# EAGLE design clockbuddy (EAGLE 9.6.2)
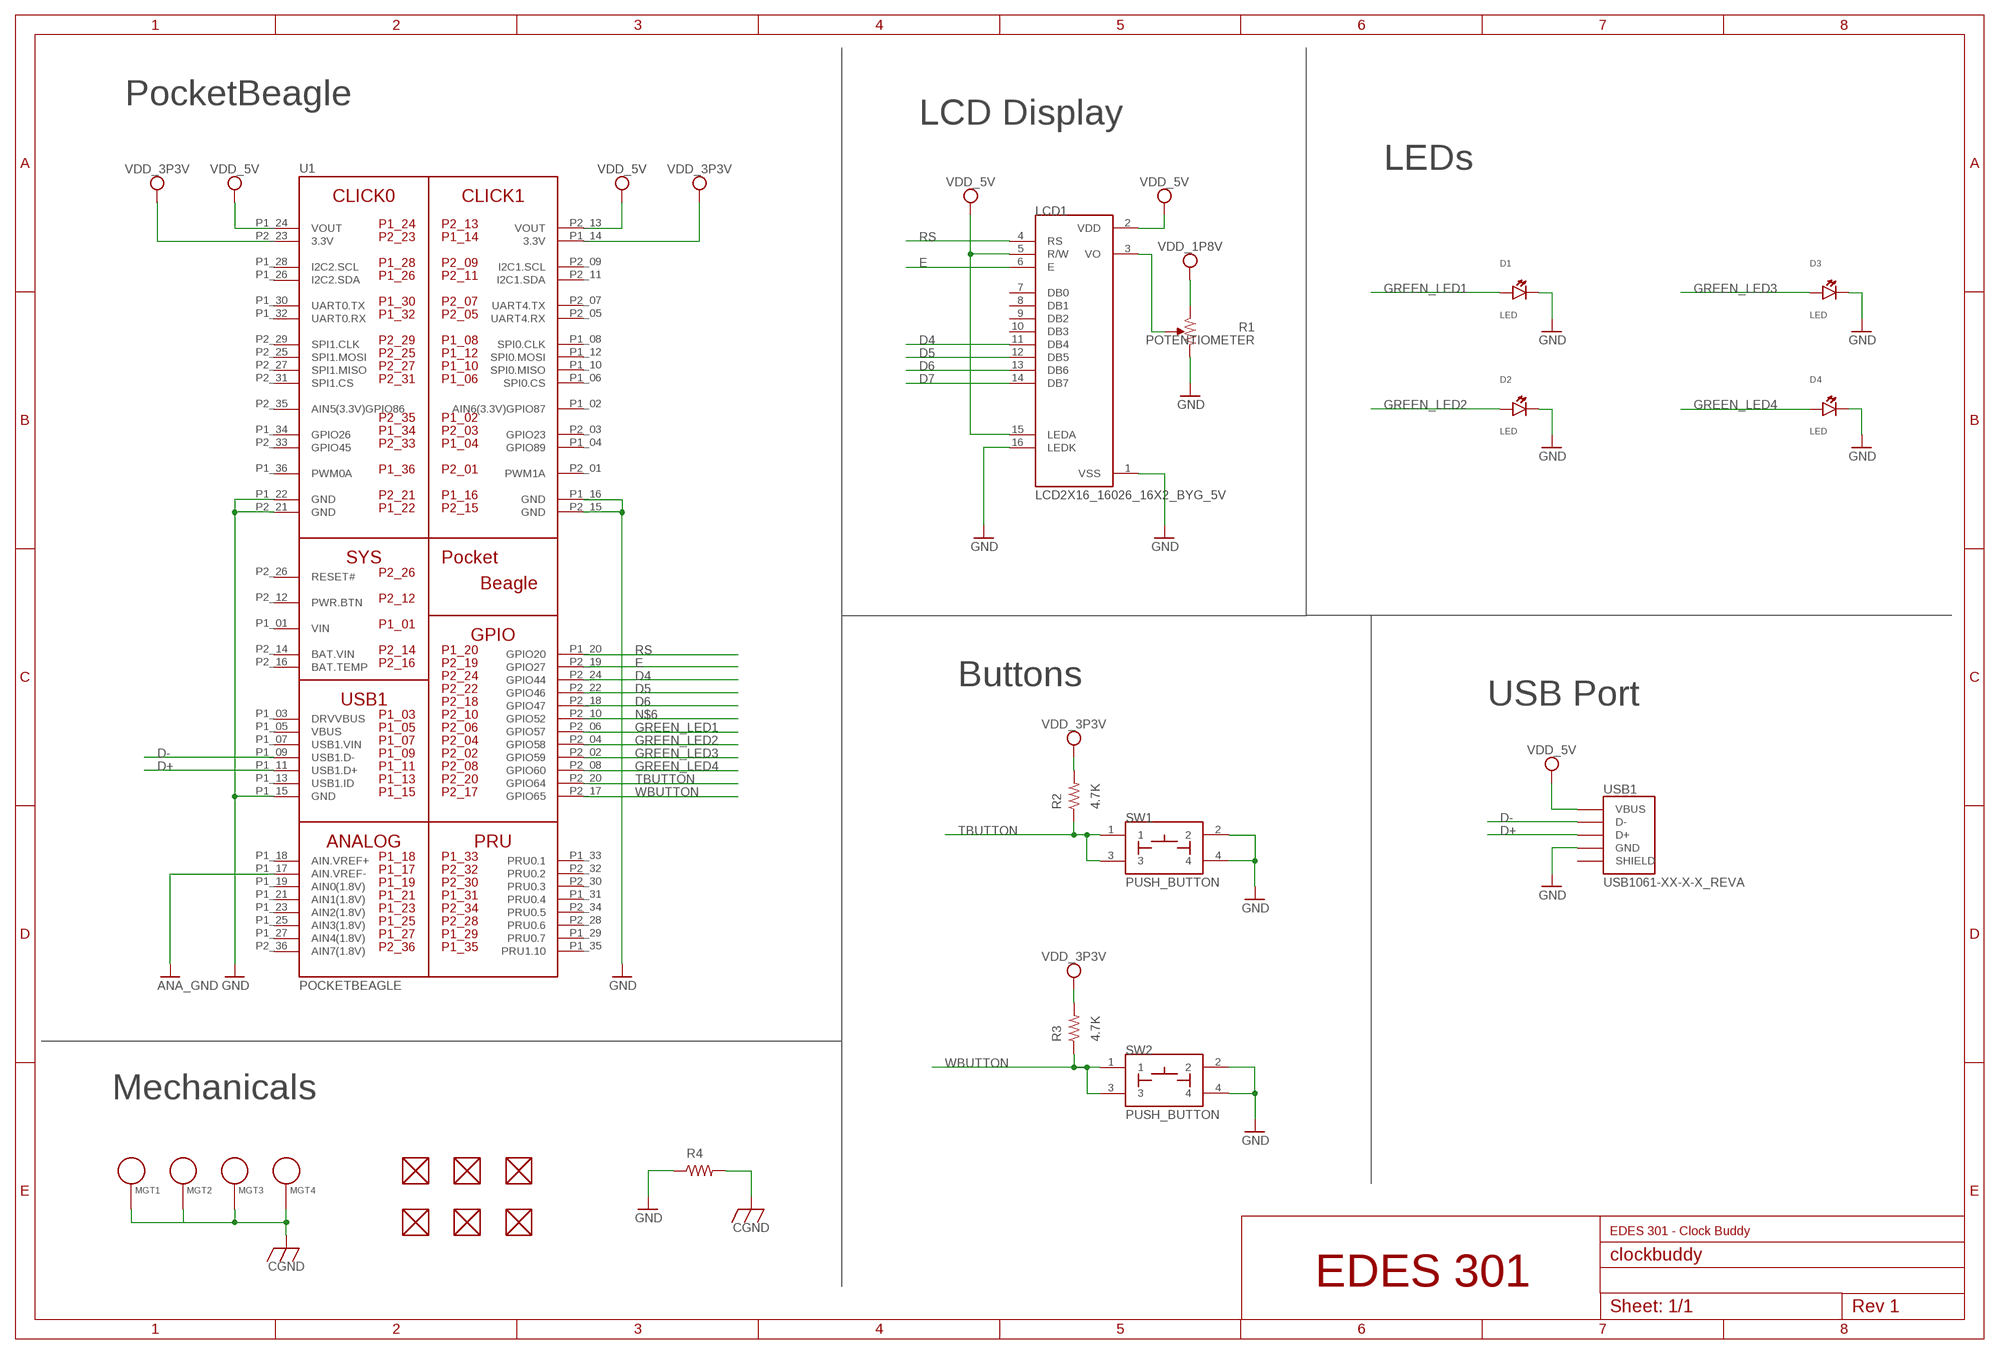
[diagram p0: schematic, sheet 1]

## Parts
D1  LED  [EIA-STD]
D2  LED  [EIA-STD]
D3  LED  [EIA-STD]
D4  LED  [EIA-STD]
FUD1  FIDUCIAL  [FIDUCIAL_40MIL]
FUD2  FIDUCIAL  [FIDUCIAL_40MIL]
FUD3  FIDUCIAL  [FIDUCIAL_40MIL]
FUD4  FIDUCIAL  [FIDUCIAL_40MIL]
FUD5  FIDUCIAL  [FIDUCIAL_40MIL]
FUD6  FIDUCIAL  [FIDUCIAL_40MIL]
LCD1  LCD2X16_16026_16X2_BYG_5V  [LCD_LCD2X16]
MGT1  MOUNTING_HOLE  [MOUNTING_HOLE]
MGT2  MOUNTING_HOLE  [MOUNTING_HOLE]
MGT3  MOUNTING_HOLE  [MOUNTING_HOLE]
MGT4  MOUNTING_HOLE  [MOUNTING_HOLE]
R1  POTENTIOMETER  [POT-PO90S]
R2  4.7K  R_R0603  [R0603]
R3  4.7K  R_R0603  [R0603]
R4  R_R0805  [R0805]
SW1  PUSH_BUTTON  [BUTTON_12.5MM]
SW2  PUSH_BUTTON  [BUTTON_12.5MM]
U1  POCKETBEAGLE  [POCKETBEAGLE]
USB1  USB1061-XX-X-X_REVA  [GCT_USB1061-XX-X-X_REVA]

## Nets
ANA_GND: U1.P1_17(AIN.VREF-)
CGND: MGT1.P$1 MGT2.P$1 MGT3.P$1 MGT4.P$1 R4.2
D4: LCD1.11(DB4) U1.P2_24(GPIO44)
D5: LCD1.12(DB5) U1.P2_22(GPIO46)
D6: LCD1.13(DB6) U1.P2_18(GPIO47)
D7: LCD1.14(DB7)
D+: U1.P1_11(USB1.D+) USB1.3(D+)
D-: U1.P1_09(USB1.D-) USB1.2(D-)
E: LCD1.6(E) U1.P2_19(GPIO27)
GND: D1.CATHODE D2.CATHODE D3.CATHODE D4.CATHODE LCD1.1(VSS) LCD1.16(LEDK) R1.CW R4.1 SW1.2 SW1.4 SW2.2 SW2.4 U1.P1_15(GND) U1.P1_16(GND) U1.P1_22(GND) U1.P2_15(GND) U1.P2_21(GND) USB1.4(GND)
GREEN_LED1: D1.ANODE U1.P2_06(GPIO57)
GREEN_LED2: D2.ANODE U1.P2_04(GPIO58)
GREEN_LED3: D3.ANODE U1.P2_02(GPIO59)
GREEN_LED4: D4.ANODE U1.P2_08(GPIO60)
N$6: U1.P2_10(GPIO52)
N$9: LCD1.3(VO) R1.S
RS: LCD1.4(RS) U1.P1_20(GPIO20)
TBUTTON: R2.1 SW1.1 SW1.3 U1.P2_20(GPIO64)
VDD_1P8V: R1.CCW
VDD_3P3V: R2.2 R3.2 U1.P1_14(3.3V) U1.P2_23(3.3V)
VDD_5V: LCD1.2(VDD) LCD1.5(R/W) LCD1.15(LEDA) U1.P1_24(VOUT) U1.P2_13(VOUT) USB1.1(VBUS)
WBUTTON: R3.1 SW2.1 SW2.3 U1.P2_17(GPIO65)
Unconnected: FUD1.P$1 FUD2.P$1 FUD3.P$1 FUD4.P$1 FUD5.P$1 FUD6.P$1 LCD1.7(DB0) LCD1.8(DB1) LCD1.9(DB2) LCD1.10(DB3) U1.P1_02(AIN6(3.3V)GPIO87) U1.P1_03(DRVVBUS) U1.P1_04(GPIO89) U1.P1_05(VBUS) U1.P1_06(SPI0.CS) U1.P1_07(USB1.VIN) U1.P1_08(SPI0.CLK) U1.P1_10(SPI0.MISO) U1.P1_12(SPI0.MOSI) U1.P1_13(USB1.ID) U1.P1_18(AIN.VREF+) U1.P1_19(AIN0(1.8V)) U1.P1_21(AIN1(1.8V)) U1.P1_23(AIN2(1.8V)) U1.P1_25(AIN3(1.8V)) U1.P1_26(I2C2.SDA) U1.P1_27(AIN4(1.8V)) U1.P1_28(I2C2.SCL) U1.P1_29(PRU0.7) U1.P1_30(UART0.TX) U1.P1_31(PRU0.4) U1.P1_32(UART0.RX) U1.P1_33(PRU0.1) U1.P1_34(GPIO26) U1.P1_35(PRU1.10) U1.P1_36(PWM0A) U1.P2_01(PWM1A) U1.P2_03(GPIO23) U1.P2_05(UART4.RX) U1.P2_07(UART4.TX) U1.P2_09(I2C1.SCL) U1.P2_11(I2C1.SDA) U1.P2_12(PWR.BTN) U1.P2_16(BAT.TEMP) U1.P2_25(SPI1.MOSI) U1.P2_26(RESET#) U1.P2_27(SPI1.MISO) U1.P2_28(PRU0.6) U1.P2_29(SPI1.CLK) U1.P2_30(PRU0.3) U1.P2_31(SPI1.CS) U1.P2_32(PRU0.2) U1.P2_33(GPIO45) U1.P2_34(PRU0.5) U1.P2_35(AIN5(3.3V)GPIO86) U1.P2_36(AIN7(1.8V))

## Notes on the sheet
- PocketBeagle
- LCD Display
- LEDs
- Buttons
- USB Port
- Mechanicals
- EDES 301 - Clock Buddy
- EDES 301
- 1/1

## Power pins joined to a net without a drawn wire
BAT.VIN: U1.P2_14(BAT.VIN)
SHIELD: USB1.5(SHIELD) USB1.6(SHIELD)
VIN: U1.P1_01(VIN)

## Library data of the parts
D1-D4 = clockbuddy:LED: EIA-STD LED, LTST-C191TBKT
FUD1-FUD6 = clockbuddy:FIDUCIAL
LCD1 = clockbuddy:LCD2X16: Check availability <https://pricing.snapeda.com/parts/LCD2X16/mikroElektronika/view-part?ref=eda>; AVAILABILITY: Not in stock; CHECK_PRICES: https://www.snapeda.com/parts/LCD2X16/mikroElektronika/view-part/?ref=eda; DESCRIPTION: Display; Display: LCD 2x16 characters (blue backlight); MF: mikroElektronika; MP: LCD2X16; PACKAGE: None; PRICE: None; SNAPEDA_LINK: https://www.snapeda.com/parts/LCD2X16/mikroElektronika/view-part/?ref=snap
MGT1-MGT4 = clockbuddy:MOUNTING_HOLE: Chassis Mounting Hole w/GND connection ability
R1 = clockbuddy:POTENTIOMETER: Potentiometer - Examples: P090S-14T20BR10K (987-1277-ND)
R2-R4 = clockbuddy:R_: RESISTOR, American symbol
SW1 SW2 = clockbuddy:PUSH_BUTTON
U1 = clockbuddy:POCKETBEAGLE
USB1 = clockbuddy:USB1061-XX-X-X_REVA: Check availability <https://pricing.snapeda.com/parts/USB1061-GF-L-A/Global%20Connector%20Technology/view-part?ref=eda>; AVAILABILITY: In Stock; CHECK_PRICES: https://www.snapeda.com/parts/USB1061-GF-L-A/Global+Connector+Technology/view-part/?ref=eda; DESCRIPTION: USB-A (USB TYPE-A) USB 2.0 Plug Connector 4 Position Board Edge, Cutout; Surface Mount; Through Hole, Right Angle; MF: Global Connector Technology; MP: USB1061-GF-L-A; PACKAGE: None; PRICE: None; SNAPEDA_LINK: https://www.snapeda.com/parts/USB1061-GF-L-A/Global+Connector+Technology/view-part/?ref=snap

## Board
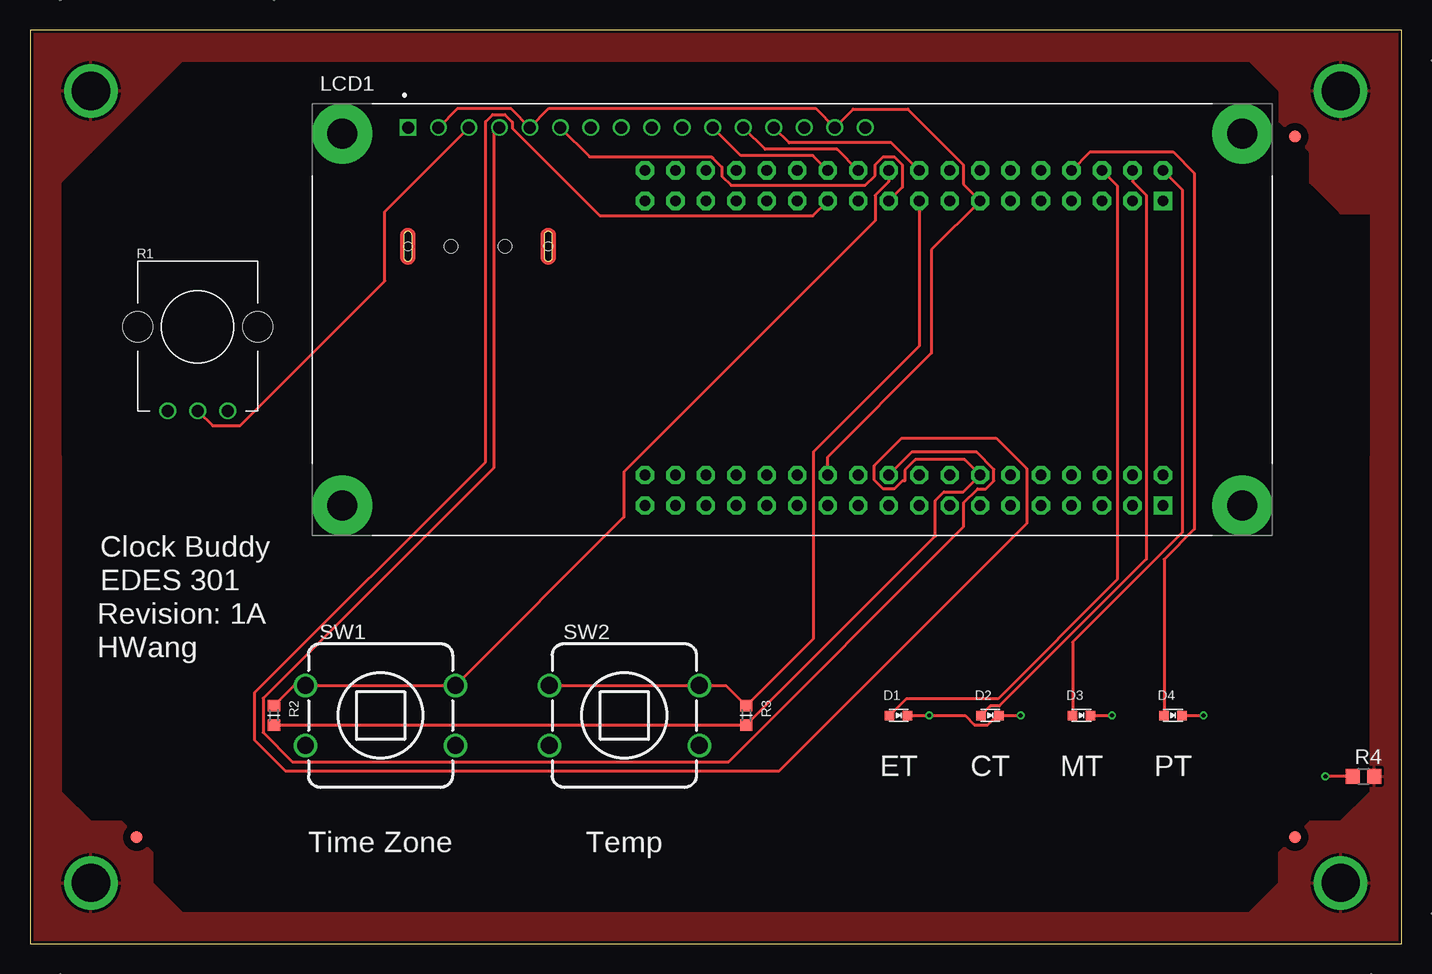
[diagram p1: board, top side]
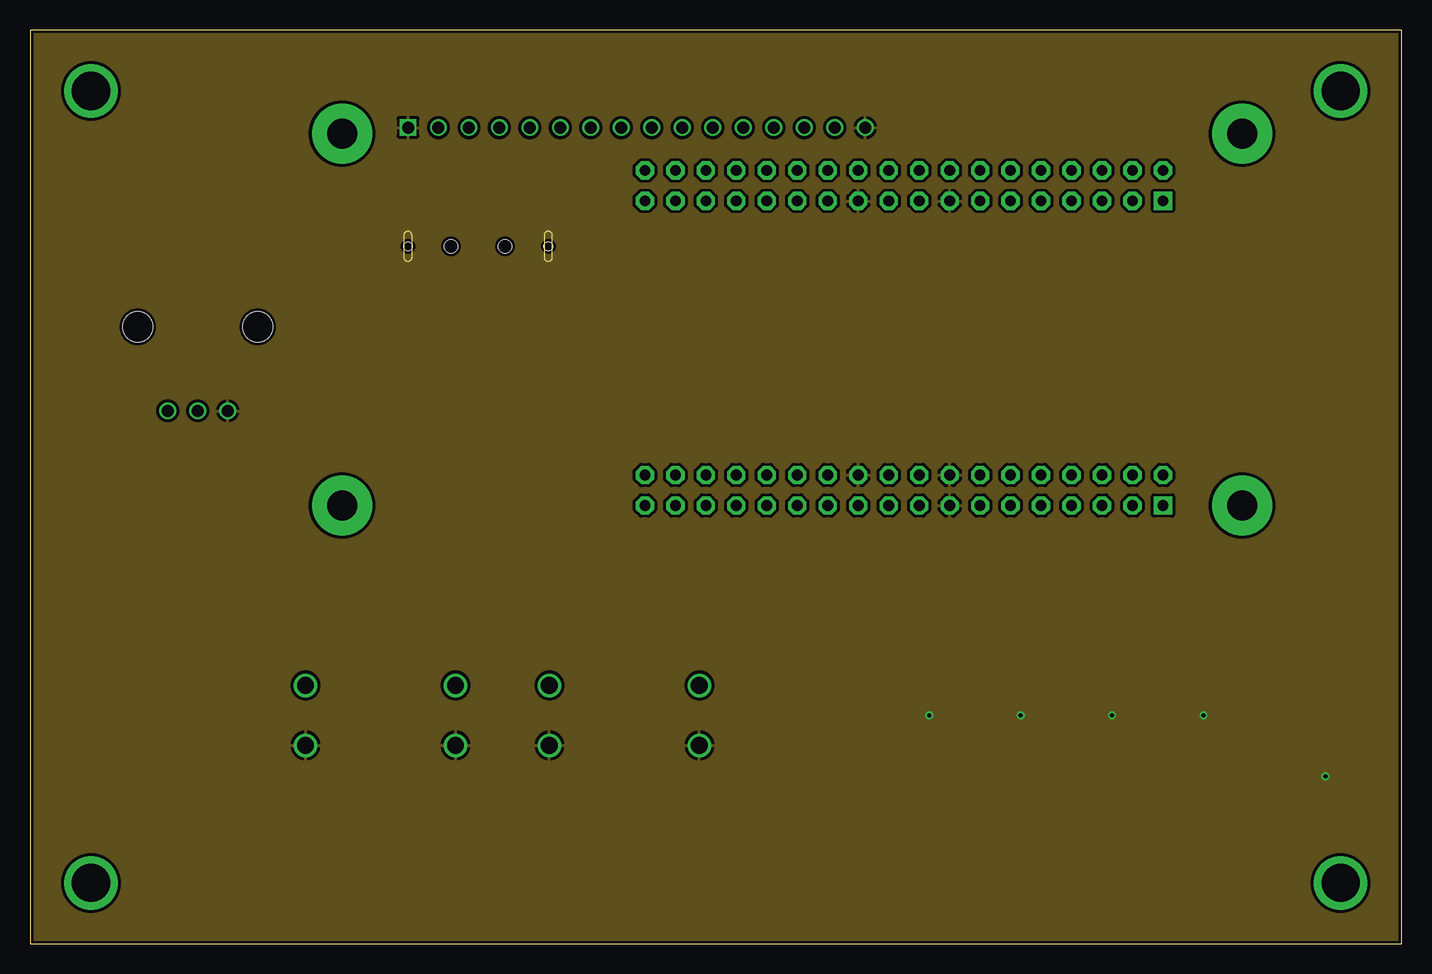
[diagram p2: board, inner layer Route2]
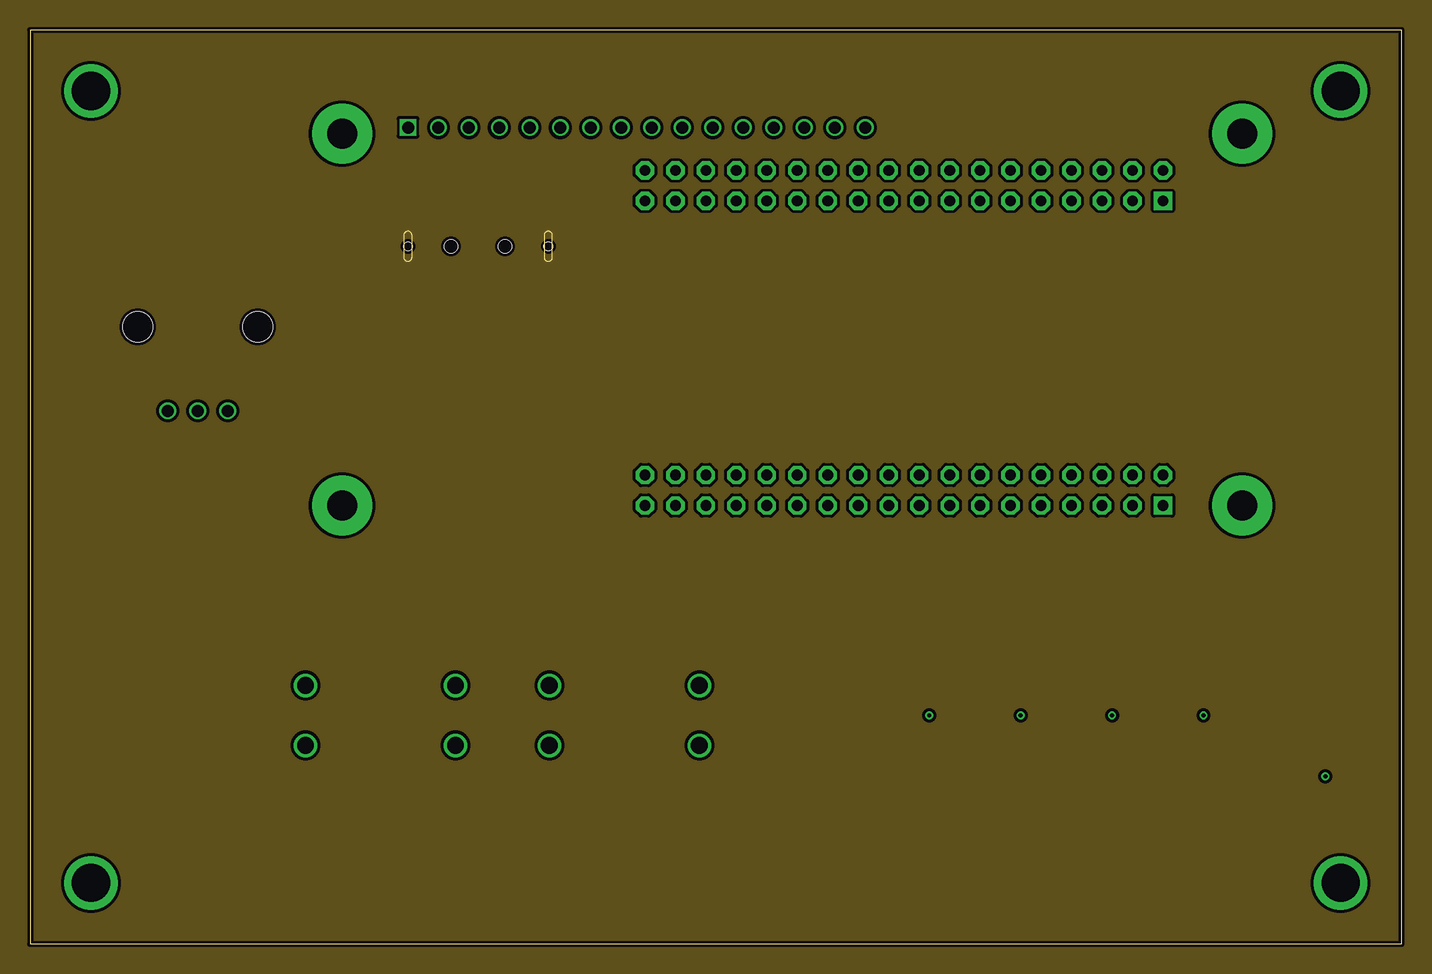
[diagram p3: board, inner layer Route15]
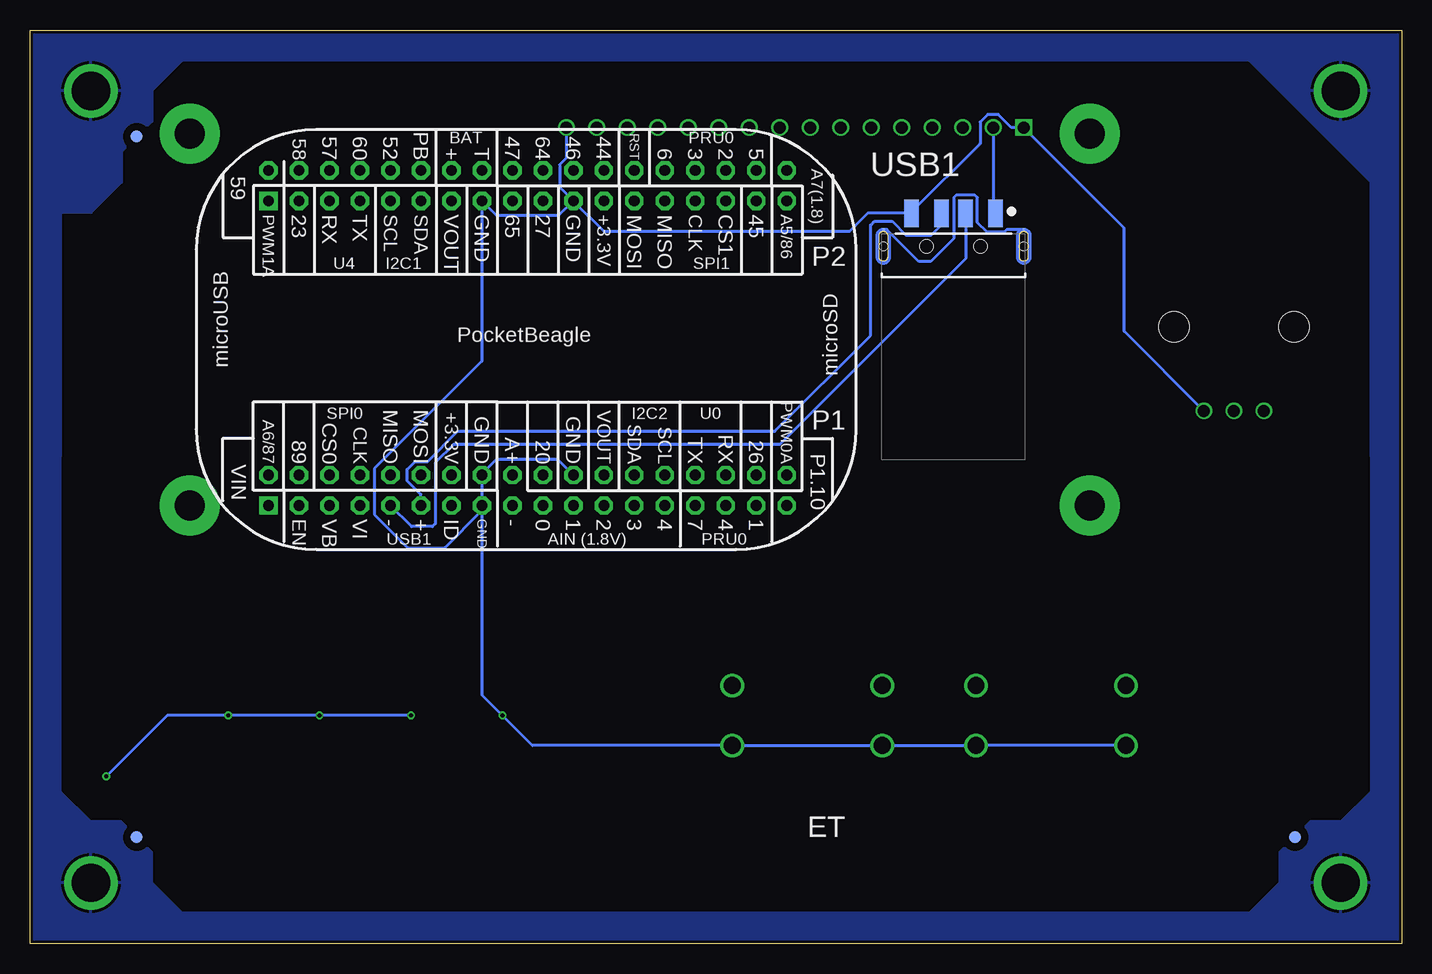
[diagram p4: board, bottom side, seen from below]

Size 114.3 x 76.2 mm. Coordinates in mm from the lower left corner, seen from the top.
Outline: 0,0 114.3,0 114.3,76.2 0,76.2 0,0
Copper layers (1*2*15*16): Top 0.035mm / dielectric 0.23mm / Route2 0.035mm / dielectric 0.93mm / Route15 0.035mm / dielectric 0.23mm / Bottom 0.035mm
Design rules "ENGI301_4lyr": minimum track width 10mil, minimum drill 12mil, track to track 10mil, track to pad 10mil, pad to pad 10mil, via to via 10mil, smd to smd 10mil, copper to edge 10mil, drill to drill 12mil, minimum pad ring 6mil, minimum via ring 6mil, stop-mask expansion 3mil, vias tented up to drill 25mil, thermal gap 10mil

### Footprints (pad centres in the part's own frame; a part is rotated, then mirrored left to right if it is on the bottom)
EIA-STD = smd 0.8 x 0.8: ANODE -0.75,0; CATHODE 0.75,0
FIDUCIAL_40MIL = smd 1.016 x 1.016: P$1 0,0
LCD_LCD2X16 = drill 1 square: 1 -32,16 | drill 1: 2 -29.46,16; 3 -26.92,16; 4 -24.38,16; 5 -21.84,16; 6 -19.3,16; 7 -16.76,16; 8 -14.22,16; 9 -11.68,16; 10 -9.14,16; 11 -6.6,16; 12 -4.06,16; 13 -1.52,16; 14 1.02,16; 15 3.56,16; 16 6.1,16 | drill 2.5 pad 5: S1 -37.5,15.5; S2 37.5,15.5; S3 37.5,-15.5; S4 -37.5,-15.5
MOUNTING_HOLE = drill 3.175 pad 4.445: P$1 0,0
POT-PO90S = drill 1: CCW -2.5,0; CW 2.5,0; S 0,0 | hole 2.5: -5,7; 5,7
R0603 = smd 0.95 x 1.031: 1 -0.8,0; 2 0.8,0
R0805 = smd 1.143 x 1.27: 1 -0.889,0; 2 0.889,0
BUTTON_12.5MM = drill 1.4: 1 -6.25,2.5; 2 -6.25,-2.5; 3 6.25,2.5; 4 6.25,-2.5
POCKETBEAGLE = drill 0.889 pad 1.524 square: P1_01 5.91,3.53; P2_01 5.91,28.93 | drill 0.889 pad 1.524 octagon: P1_02 5.91,6.07; P1_03 8.45,3.53; P1_04 8.45,6.07; P1_05 10.99,3.53; P1_06 10.99,6.07; P1_07 13.53,3.53; P1_08 13.53,6.07; P1_09 16.07,3.53; P1_10 16.07,6.07; P1_11 18.61,3.53; P1_12 18.61,6.07; P1_13 21.15,3.53; P1_14 21.15,6.07; P1_15 23.69,3.53; P1_16 23.69,6.07; P1_17 26.23,3.53; P1_18 26.23,6.07; P1_19 28.77,3.53; P1_20 28.77,6.07; P1_21 31.31,3.53; P1_22 31.31,6.07; P1_23 33.85,3.53; P1_24 33.85,6.07; P1_25 36.39,3.53; P1_26 36.39,6.07; P1_27 38.93,3.53; P1_28 38.93,6.07; P1_29 41.47,3.53; P1_30 41.47,6.07; P1_31 44.01,3.53; P1_32 44.01,6.07; P1_33 46.55,3.53; P1_34 46.55,6.07; P1_35 49.09,3.53; P1_36 49.09,6.07; P2_02 5.91,31.47; P2_03 8.45,28.93; P2_04 8.45,31.47; P2_05 10.99,28.93; P2_06 10.99,31.47; P2_07 13.53,28.93; P2_08 13.53,31.47; P2_09 16.07,28.93; P2_10 16.07,31.47; P2_11 18.61,28.93; P2_12 18.61,31.47; P2_13 21.15,28.93; P2_14 21.15,31.47; P2_15 23.69,28.93; P2_16 23.69,31.47; P2_17 26.23,28.93; P2_18 26.23,31.47; P2_19 28.77,28.93; P2_20 28.77,31.47; P2_21 31.31,28.93; P2_22 31.31,31.47; P2_23 33.85,28.93; P2_24 33.85,31.47; P2_25 36.39,28.93; P2_26 36.39,31.47; P2_27 38.93,28.93; P2_28 38.93,31.47; P2_29 41.47,28.93; P2_30 41.47,31.47; P2_31 44.01,28.93; P2_32 44.01,31.47; P2_33 46.55,28.93; P2_34 46.55,31.47; P2_35 49.09,28.93; P2_36 49.09,31.47
GCT_USB1061-XX-X-X_REVA = smd 1.2 x 2.3: 1 3.5,2.75; 2 1,2.75; 3 -1,2.75; 4 -3.5,2.75 | smd 0.2 x 0.2: 5 -5.85,1.4; 6 5.85,1.4 | hole 1.1: -2.25,0; 2.25,0 | hole 0.7: -5.85,0; 5.85,0

### Placement (x,y rotation side)
D1  72.39,19.05 0 top
D2  80.01,19.05 0 top
D3  87.63,19.05 0 top
D4  95.25,19.05 0 top
FUD1  8.89,8.89 0 top
FUD2  105.41,8.89 0 top
FUD3  105.41,67.31 0 top
FUD4  8.89,8.89 0 bottom
FUD5  105.41,8.89 0 bottom
FUD6  105.41,67.31 0 bottom
LCD1  63.5,52.07 0 top
MGT1  5.08,5.08 0 top
MGT2  5.08,71.12 0 top
MGT3  109.22,71.12 0 top
MGT4  109.22,5.08 0 top
R1  13.97,44.45 0 top
R2  20.32,19.05 270 top
R3  59.69,19.05 270 top
R4  111.12,13.97 0 top
SW1  29.21,19.05 0 top
SW2  49.53,19.05 0 top
U1  100.33,33.02 0 bottom
USB1  37.34,58.17 0 bottom

### Tracks (layer width: path | path; a pad name or v marks a point on that pad's centre or on a via)
CGND
  pour Top: -2.54,40.64 2.54,40.64 2.54,12.7 5.08,10.16 7.62,10.16 10.16,7.62 10.16,5.08 12.7,2.54 101.6,2.54 104.14,5.08 104.14,7.62 106.68,10.16 109.22,10.16 111.76,12.7 111.76,40.64 116.84,40.64 116.84,-2.54 -2.54,-2.54
  pour Top: 2.54,40.64 2.54,63.5 5.08,66.04 12.7,73.66 101.6,73.66 104.14,71.12 104.14,68.58 106.68,66.04 106.68,63.5 109.22,60.96 111.76,60.96 111.76,40.64 116.84,40.64 116.84,78.74 -2.54,78.74 -2.54,40.64
  pour Bottom: -2.54,40.64 2.54,40.64 2.54,12.7 5.08,10.16 7.62,10.16 10.16,7.62 10.16,5.08 12.7,2.54 101.6,2.54 104.14,5.08 104.14,7.62 106.68,10.16 109.22,10.16 111.76,12.7 111.76,40.64 116.84,40.64 116.84,-2.54 -2.54,-2.54
  pour Bottom: -2.54,40.64 2.54,40.64 2.54,63.5 12.7,73.66 101.6,73.66 104.14,71.12 104.14,68.58 106.68,66.04 106.68,63.5 109.22,60.96 111.76,60.96 111.76,40.64 116.84,40.64 116.84,76.2 116.84,78.74 -2.54,78.74
D4
  Top 0.254: LCD1.11 59.23,65.73 65.23,65.73 U1.P2_24
D5
  Top 0.254: U1.P2_22 67.27,66.24 61.27,66.24 LCD1.12
D6
  Top 0.254: U1.P2_18 71.79,66.8 63.25,66.8 LCD1.13
D+
  Bottom 0.254: U1.P1_11 81.72,37.47 82.86,38.62 82.86,39.56 82.19,40.23 81.15,40.23 78.64,42.75 52.22,42.75 44.25,50.72 44.25,59.94 43.94,60.25 42.46,60.25 41.31,59.1 39.2,59.1 38.34,59.96 USB1.3
D-
  Bottom 0.254: USB1.2 36.34,57.13 51.82,41.66 78.99,41.66 80.52,40.13 80.52,35.05 80.77,34.8 82.51,34.8 U1.P1_09
E
  Top 0.254: 56.89,65.53 56.79,65.63 46.64,65.63 LCD1.6 | 56.89,65.53 56.9,65.53 | 56.89,65.53 57.66,64.77 57.66,64.01 58.42,63.25 69.6,63.25 70.42,64.07 70.42,64.96 71.09,65.63 72.03,65.63 72.13,65.53 72.14,65.53 72.7,64.96 72.7,63.09 U1.P2_19
GND  (via drill 0.35)
  Top 0.254: R4.1 v107.95,13.97 | D3.CATHODE v90.17,19.05 | D4.CATHODE v97.79,19.05 | v82.55,19.05 D2.CATHODE 80.6,19.05 79.82,18.27 78.7,18.27 77.92,19.05 v74.93,19.05 D1.CATHODE
  Bottom 0.254: R1.CW 23.11,51.09 23.11,59.68 LCD1.1 32.51,68.07 33.59,69.15 34.49,69.15 35.12,68.52 35.12,66.73 40.89,60.96 | LCD1.16 69.6,65.53 70.16,64.96 70.16,63.09 U1.P2_21 | U1.P2_21 70.26,60.71 75.4,60.71 U1.P2_15 76.64,48.58 85.6,39.62 85.6,35.81 82.8,33.02 79.76,33.02 76.64,36.14 U1.P1_15 | U1.P2_21 66.51,59.44 45.97,59.44 44.45,60.96 40.89,60.96 | 40.89,60.96 40.88,60.96 USB1.4 | U1.P1_15 U1.P1_16 76.64,39.18 75.44,40.39 70.32,40.39 U1.P1_22 | U1.P1_15 76.64,20.76 v74.93,19.05 72.43,16.55 SW2.4 SW2.2 SW1.4 SW1.2 | v82.55,19.05 v90.17,19.05 v97.79,19.05 102.87,19.05 v107.95,13.97
  pour Route2 (rank 6): -5.08,81.28 119.38,81.28 119.38,-5.08 -5.08,-5.08
GREEN_LED1
  Top 0.254: U1.P2_06 90.6,63.23 90.6,30.38 80.67,20.45 73.04,20.45 D1.ANODE
GREEN_LED2
  Top 0.254: U1.P2_04 91.88,63.57 93.02,62.42 93.02,32.08 80.77,19.83 80.04,19.83 D2.ANODE
GREEN_LED3
  Top 0.254: U1.P2_02 96.01,62.9 96.01,34.3 86.88,25.17 D3.ANODE
GREEN_LED4
  Top 0.254: U1.P2_08 88.35,66.04 95.25,66.04 97.03,64.26 97.03,34.58 94.5,32.05 D4.ANODE
N$9
  Top 0.254: R1.S 15.21,43.2 17.5,43.2 29.57,55.27 29.57,61.06 LCD1.3
RS
  Top 0.254: LCD1.4 38.99,68.07 38.64,67.71 38.64,39.7 19.42,20.48 19.42,17.62 21.85,15.19 58.21,15.19 77.78,34.76 77.78,36.77 78.96,37.95 79.65,37.95 80.32,38.62 80.32,39.56 78.89,40.99 73.47,40.99 U1.P1_20
SHIELD
  Bottom 0.254: USB1.6 32.9,59.57 33.13,59.33 34.55,59.33 35.36,60.15 35.36,62.22 35.58,62.45 37.1,62.45 37.32,62.22 37.32,58.82 39.24,56.9 40.23,56.9 42.9,59.57 USB1.5
TBUTTON
  Top 0.254: R2.1 22.02,21.55 SW1.1 SW1.3 49.49,35.58 49.49,39.36 70.42,60.29 70.42,62.42 71.56,63.57 U1.P2_20
VDD_3D3V
  pour Route15 (rank 6): -7.62,83.82 121.92,83.82 121.92,-7.62 -7.62,-7.62
VDD_3P3V
  Top 0.254: R2.2 R3.2 75.44,34 75.44,36.96 76.17,37.69 77.78,37.69 U1.P1_14 77.88,40.39 73.78,40.39 72.9,39.5 72.9,38.61 72.69,38.61 72.03,37.95 71.09,37.95 70.36,38.68 70.36,39.88 72.64,42.16 80.52,42.16 83.06,39.62 83.06,35.05 62.41,14.4 21.31,14.4 18.75,16.97 18.75,20.98 37.96,40.2 37.96,68.57 38.55,69.15 39.57,69.15 40.2,68.52 40.2,68 47.49,60.71 65.24,60.71 U1.P2_23
VDD_5V
  Top 0.254: LCD1.2 35.63,69.66 40.07,69.66 LCD1.5 43.25,69.66 65.47,69.66 LCD1.15 68.59,69.6 73.15,69.6 77.78,64.96 77.78,63.35 U1.P2_13 75.12,57.89 75.12,49.25 66.48,40.61 U1.P1_24
  Bottom 0.254: LCD1.2 34.04,61.12 USB1.1
WBUTTON
  Top 0.254: SW2.1 SW2.3 57.99,21.55 R3.1 65.28,25.44 65.28,41.02 74.1,49.84 U1.P2_17

### Text on the board
tPlace: Clock Buddy | EDES 301 | Revision: 1A | HWang | ET | CT | MT | PT | Time Zone | Temp
bPlace: ET